# EAGLE schematic Adafruit ESP8266 Feather (EAGLE 9.6.2)
COMPANY: ADAFRUIT INDUSTRIES; DRAWN: KTOWN; REV: B

## Sheet 1 of 2
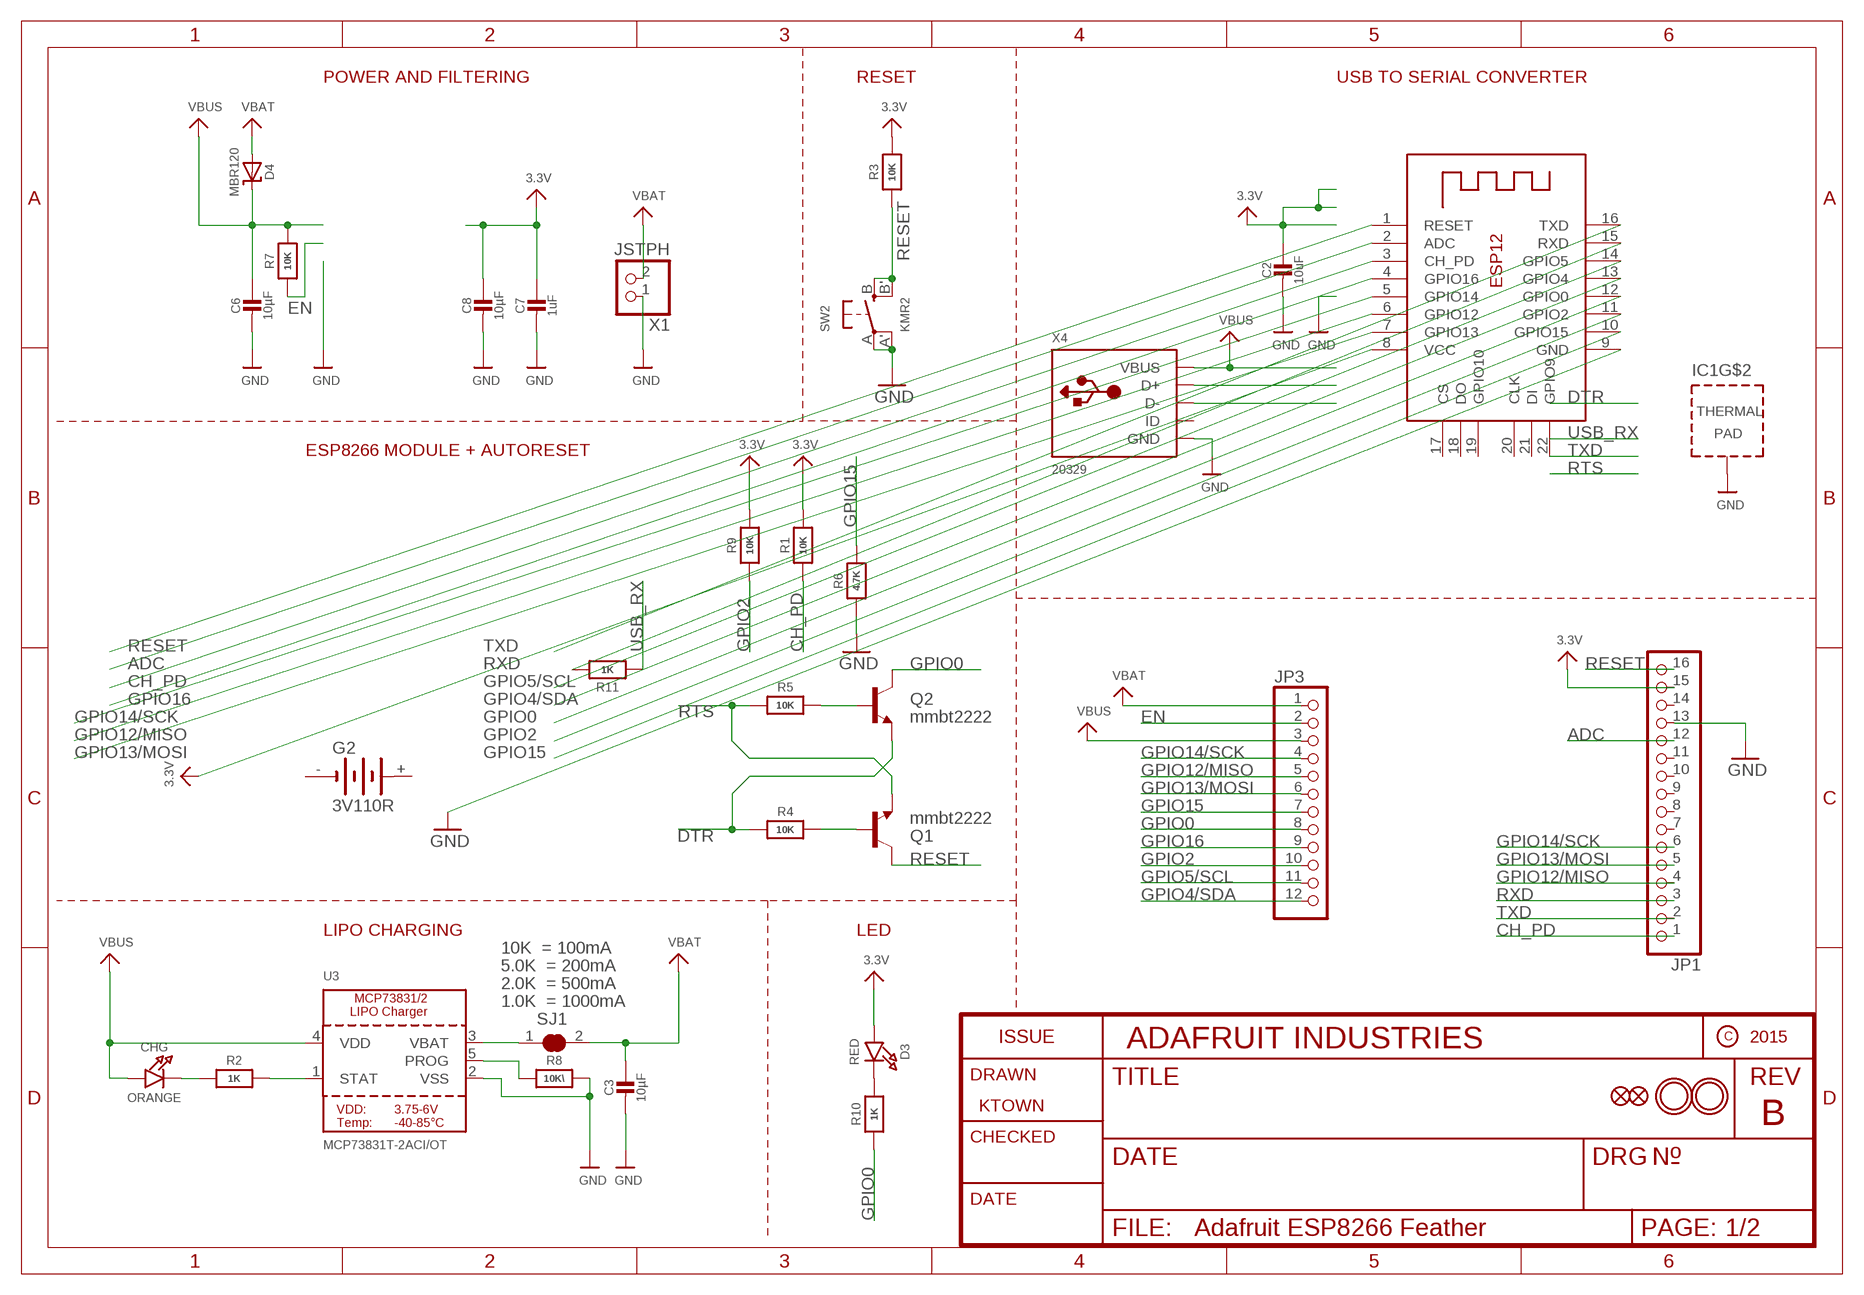
[diagram p0: schematic, sheet 1]

### Parts
C2  10uF  CAP_CERAMIC0805-NOOUTLINE  [0805-NO]
C3  10µF  CAP_CERAMIC0805-NOOUTLINE  [0805-NO]
C6  10µF  CAP_CERAMIC0805-NOOUTLINE  [0805-NO]
C7  1uF  CAP_CERAMIC0603_NO  [0603-NO]
C8  10µF  CAP_CERAMIC0805-NOOUTLINE  [0805-NO]
CHG  ORANGE  LED0805_NOOUTLINE  [CHIPLED_0805_NOOUTLINE]
D3  RED  LED0805_NOOUTLINE  [CHIPLED_0805_NOOUTLINE]
D4  MBR120  DIODE-SCHOTTKYSOD-123  [SOD-123]
G2  3V110R  [3V110R]
IC1  CP2104  [QFN24_4MM_SMSC]
JP1  HEADER-1X16ROUND  [1X16_ROUND]
JP3  HEADER-1X12  [1X12_ROUND]
Q1  mmbt2222  TRANSISTOR_NPNSOT23-3  [SOT23-3]
Q2  mmbt2222  TRANSISTOR_NPNSOT23-3  [SOT23-3]
R1  10K  RESISTOR_0603_NOOUT  [0603-NO]
R2  1K  RESISTOR_0603_NOOUT  [0603-NO]
R3  10K  RESISTOR_0603_NOOUT  [0603-NO]
R4  10K  RESISTOR_0603_NOOUT  [0603-NO]
R5  10K  RESISTOR_0603MP  [_0603MP]
R6  4.7K  RESISTOR_0603_NOOUT  [0603-NO]
R7  10K  RESISTOR_0603_NOOUT  [0603-NO]
R8  10K\  RESISTOR_0603_NOOUT  [0603-NO]
R9  10K  RESISTOR_0603_NOOUT  [0603-NO]
R10  1K  RESISTOR_0603_NOOUT  [0603-NO]
R11  1K  RESISTOR_0603MP  [_0603MP]
SJ1  SOLDERJUMPER_CLOSED  [SOLDERJUMPER_CLOSEDWIRE]
SW2  KMR2  SWITCH_TACT_SMT4.6X2.8  [BTN_KMR2_4.6X2.8]
U3  MCP73831T-2ACI/OT  MCP73831/2  [SOT23-5]
U$31  MOUNTINGHOLE2.5  [MOUNTINGHOLE_2.5_PLATED]
U$32  MOUNTINGHOLE2.5  [MOUNTINGHOLE_2.5_PLATED]
U$34  FIDUCIAL""  [FIDUCIAL_1MM]
U$35  FIDUCIAL""  [FIDUCIAL_1MM]
X1  JSTPH  CON_JST_PH_2PIN  [JSTPH2]
X2  ESP-12  ESP-12E  [ESP-12E]
X4  20329  USB_MICRO_20329_V2  [4UCONN_20329_V2]

### Nets
3.3V: C2.1 C7.1 C8.1 D3.A JP1.15 R1.2 R3.2 R9.2 X2.8(VCC)
ADC: JP1.12 X2.2(ADC)
CH_PD: JP1.1 R1.1 X2.3(CH_PD)
DTR: Q2.2(E) R4.1
EN: JP3.2 R7.1
GND: C2.2 C3.2 C6.2 C7.2 C8.2 IC1.THERM(TP) JP1.13 R6.1 R8.2 SW2.A'(P1) SW2.A(P) U3.2(VSS) X1.1 X2.9(GND) X4.BASE@1(GND) X4.BASE@2(GND) X4.GND X4.SPRT@1(GND) X4.SPRT@2(GND) X4.SPRT@3(GND) X4.SPRT@4(GND)
GPIO0: JP3.8 Q2.3(C) R10.1 X2.12(GPIO0)
GPIO2: JP3.10 R9.1 X2.11(GPIO2)
GPIO4/SDA: JP3.12 X2.13(GPIO4)
GPIO5/SCL: JP3.11 X2.14(GPIO5)
GPIO12/MISO: JP1.4 JP3.5 X2.6(GPIO12)
GPIO13/MOSI: JP1.5 JP3.6 X2.7(GPIO13)
GPIO14/SCK: JP1.6 JP3.4 X2.5(GPIO14)
GPIO15: JP3.7 R6.2 X2.10(GPIO15)
GPIO16: JP3.9 X2.4(GPIO16)
N$1: CHG.C R2.1
N$2: X4.D+
N$3: R2.2 U3.1(STAT)
N$4: R8.1 U3.5(PROG)
N$5: D3.C R10.2
N$6: X4.D-
N$7: SJ1.1 U3.3(VBAT)
N$12: Q1.1(B) R4.2
N$13: Q2.1(B) R5.2
RESET: JP1.16 Q1.3(C) R3.1 SW2.B'(S1) SW2.B(S) X2.1(RESET)
RTS: Q1.2(E) R5.1
RXD: JP1.3 R11.2 X2.15(RXD)
TXD: JP1.2 X2.16(TXD) X2.22(GPIO9)
USB_RX: R11.1
VBAT: C3.1 D4.A JP3.1 SJ1.2 X1.2
VBUS: C6.1 CHG.A D4.C JP3.3 R7.2 U3.4(VDD) X4.VBUS
Unconnected: G2.+ G2.+@1(+) G2.- IC1.1(RI) IC1.3(D+) IC1.4(D-) IC1.9(#RST) IC1.10(NC) IC1.11(GPIO3) IC1.12(GPIO2) IC1.13(GPIO1/RXLED) IC1.14(GPIO0/TXLED) IC1.15(#SUSPEND) IC1.16(VPP) IC1.17(SUSPEND) IC1.18(CTS) IC1.19(RTS) IC1.20(RXD) IC1.21(TXD) IC1.22(DSR) IC1.23(DTR) IC1.24(DCD) JP1.7 JP1.8 JP1.9 JP1.10 JP1.11 JP1.14 X2.17(CS) X2.18(DO) X2.19(GPIO10) X2.20(CLK) X2.21(DI) X4.ID

### Notes on the sheet
- POWER AND FILTERING | RESET | USB TO SERIAL CONVERTER
- ESP8266 MODULE + AUTORESET
- LIPO CHARGING | LED
- 10K  = 100mA
- 5.0K  = 200mA
- 2.0K  = 500mA
- 1.0K  = 1000mA

## Sheet 2 of 2
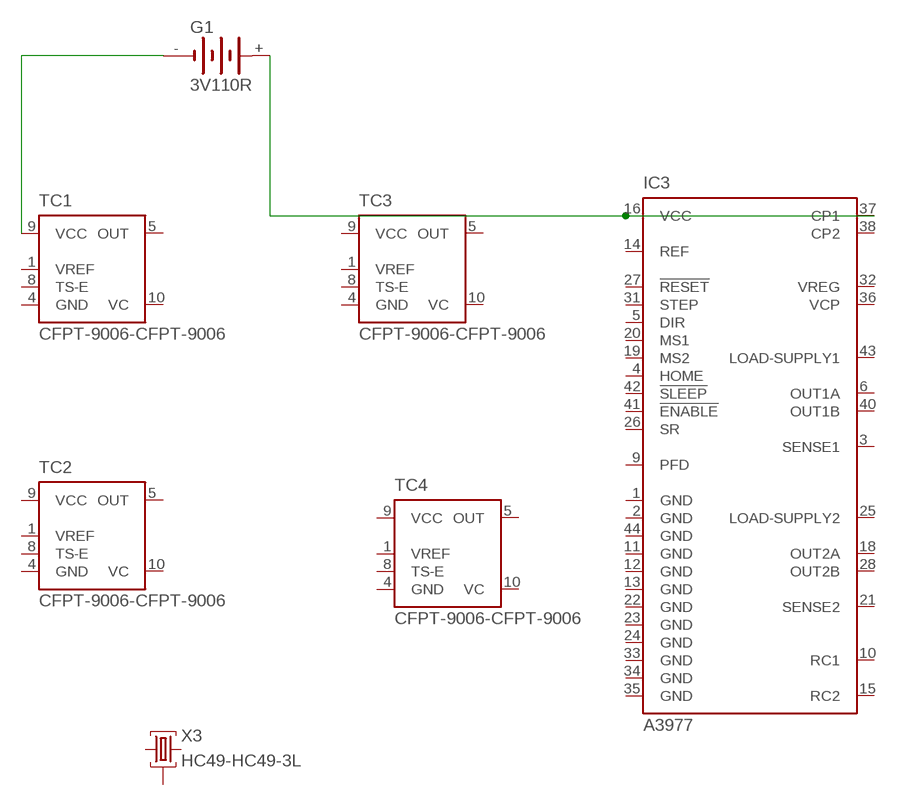
[diagram p1: schematic, sheet 2]

### Parts
G1  3V110R  [3V110R]
IC3  A3977  [PLCC44]
TC1  CFPT-9006-CFPT-9006  [7.0X5.0-10-PAD]
TC2  CFPT-9006-CFPT-9006  [7.0X5.0-10-PAD]
TC3  CFPT-9006-CFPT-9006  [7.0X5.0-10-PAD]
TC4  CFPT-9006-CFPT-9006  [7.0X5.0-10-PAD]
X3  HC49-HC49-3L  [HC49-3L]

### Nets
N$8: G1.- TC1.9(VCC)
N$9: G1.+ IC3.16(VCC) IC3.37(CP1)
Unconnected: G1.+@1(+) IC3.3(SENSE1) IC3.4(HOME) IC3.5(DIR) IC3.6(OUT1A) IC3.9(PFD) IC3.10(RC1) IC3.14(REF) IC3.15(RC2) IC3.18(OUT2A) IC3.19(MS2) IC3.20(MS1) IC3.21(SENSE2) IC3.25(LOAD-SUPPLY2) IC3.26(SR) IC3.27(!RESET) IC3.28(OUT2B) IC3.31(STEP) IC3.32(VREG) IC3.36(VCP) IC3.38(CP2) IC3.40(OUT1B) IC3.41(!ENABLE) IC3.42(!SLEEP) IC3.43(LOAD-SUPPLY1) TC1.1(VREF) TC1.5(OUT) TC1.8(TS-E) TC1.10(VC) TC2.1(VREF) TC2.5(OUT) TC2.8(TS-E) TC2.10(VC) TC3.1(VREF) TC3.5(OUT) TC3.8(TS-E) TC3.10(VC) TC4.1(VREF) TC4.5(OUT) TC4.8(TS-E) TC4.10(VC) X3.1 X3.2 X3.3

## Power pins joined to a net without a drawn wire
GND: IC1.2(GND) IC3.1(GND) IC3.2(GND) IC3.11(GND) IC3.12(GND) IC3.13(GND) IC3.22(GND) IC3.23(GND) IC3.24(GND) IC3.33(GND) IC3.34(GND) IC3.35(GND) IC3.44(GND) TC1.4(GND) TC2.4(GND) TC3.4(GND) TC4.4(GND)
REGIN: IC1.7(REGIN)
VBUS: IC1.8(VBUS)
VCC: TC2.9(VCC) TC3.9(VCC) TC4.9(VCC)
VDD: IC1.6(VDD)
VIO: IC1.5(VIO)

## Library data of the parts
C2 C3 C6-C8 = microbuilder:CAP_CERAMIC: Ceramic Capacitors For new designs, use the packages preceded by an '_' character since they are more reliable: The following footprints should be used on most boards: _0402 - Standard footprint for regular board layouts _0603 - Standard footprint for regular board layouts _0805 - Standard footprint for regular board layouts _1206 - Standard footprint for regular board layouts For extremely tight-pitch boards where space is at a premium, the following 'micro-pitch' footprints can be used (smaller pads, no silkscreen outline, etc.): _0402MP - Micro-pitch footprint for very dense/compact boards _0603MP - Micro-pitch footprint for very dense/compact boards _0805MP - Micro-pitch footprint for very dense/compact boards _1206MP - Micro-pitch footprint for very dense/compact boards
CHG D3 = microbuilder:LED: LED 0603 - 0603 Surface Mount Package 2mA: Green LED - Low Power (3.9mcd, 2ma, 1.7Vf) - Digikey: 475-2709-2-ND Orange LED - Low Power (9.8mcd, 2ma, 1.8Vf) - Digikey: 475-1194-2-ND Red LED - Low Power (5mcd, 2ma, 1.8Vf) - Digikey: 475-1195-2-ND Yellow LED - Low Power (7mcd, 2ma, 1.8Vf) - Digikey: 475-1196-2-ND 5mA: Blue LED - Low Power (17mcd, 5ma, 2.9Vf) - Digikey: LNJ937W8CRACT-ND 0805 - 0805 Surface Mount Package 2mA: Red LED (8.8mcd, 2mA, 1.8Vf, Clear) - Low Power [Digikey: 475-2510-1-ND] Green LED (5mcd, 2mA, 1.8Vf, Clear) - Low Power [Digikey: 475-2730-1-ND] Yellow LED (11.3mcd, 2mA, 1.8Vf, Clear) - Low Power [Digikey: 475-2555-1-ND] 20mA: Red LED (104mcd, 20mA, Diffused) - LS R976 [Digikey: 475-1278-6-ND] Red LED (12mcd, 20mA, 2.0Vf, Clear) - APT2012EC [Digikey: 754-1128-1-ND] Green LED (15mcd, 20mA, 2.2Vf, Clear) - APT2012GC [Digikey: 754-1131-1-ND] Orange LED (160mcd, 20mA, 2.1Vf, Clear) - APT2012SECK [Digikey: 754-1130-1-ND] 1206 - 1206 Surface Mount Package Green LED (26mcd, 20mA, Diffused) - LG N971 [Digikey: 475-1407-6-ND] Red LED (15mcd, 20mA, Diffused) - LH N974 [Digikey: 475-1416-6-ND] Cree - Cree High-Power Surface Mount LEDs XPEBWT-L1-0000-00D50 - White 111lm 350mA 2.9Vf 6200K 110° XTEAWT-00-0000-00000LEE3 - White 114lm 350mA 2.85Vf 5000K 115° Everlight - Everlight 45-21 Series Surface Mount LEDs 45-21/QK2C-B2832AC2CB2/2T - Warm White 2000mcd 20mA 3.25Vf 3050K 120° 45-21/LK2C-B38452C4CB2/2T - Nuetral White 2000mcd 20mA 3.25Vf 4150K 120° 45-21/LK2C-B50634C6CB2/2T - Cold White 2200mcd 20mA 3.25Vf 5650K 120° PLCC2 Reverse Mount LS T77K-J1L2-1-0-2-R18-Z - Red 11.25mcd 2mA 1.8Vf 630nm 120° LO T77K-L1M2-24-Z - Orange 19.6mcd 2mA 1.8Vf 606nm 120° LY T77K-K2M1-26-Z - Yellow 15.7mcd 2mA 1.8Vf 587nm 120°
D4 = microbuilder:DIODE-SCHOTTKY
G1 G2 = battery:3V110R: NC ACCU Varta
IC1 = microbuilder:CP2104: CP2104 - USB to UART Bridge VDD Output: 3.45V
IC3 = allegro:A3977: MICROSTEPPING DMOS DRIVER WITH TRANSLATOR Source: 3977.pdf; MF: ALLEGRO MICROSYSTEMS, INC.; MPN: A3977SED-T; OC_FARNELL: 1198089; OC_NEWARK: 31K6655
JP1 = microbuilder:HEADER-1X16: PIN HEADER
JP3 = microbuilder:HEADER-1X12
Q1 Q2 = SparkFun:TRANSISTOR_NPN: Transistor NPN BJT configuration in SOT23 package. MMBT2222 is the common NPN we use. Double check BCE configuration again layout.
R1-R11 = microbuilder:RESISTOR: Resistors For new designs, use the packages preceded by an '_' character since they are more reliable: The following footprints should be used on most boards: _0402 - Standard footprint for regular board layouts _0603 - Standard footprint for regular board layouts _0805 - Standard footprint for regular board layouts _1206 - Standard footprint for regular board layouts For extremely tight-pitch boards where space is at a premium, the following 'micro-pitch' footprints can be used (smaller pads, no silkscreen outline, etc.): _0402MP - Micro-pitch footprint for very dense/compact boards _0603MP - Micro-pitch footprint for very dense/compact boards _0805MP - Micro-pitch footprint for very dense/compact boards _1206MP - Micro-pitch footprint for very dense/compact boards
SJ1 = microbuilder:SOLDERJUMPER_CLOSED: Solder Jumper - Closed These solder jumpers are closed by default CLOSEDWIRE - 10 mil trace between pads that can be cut and resoldered later CLOSEDPERM - 63 mil trace between pads for a permanent connection (used to 'bridge' two signals, a shameless hack for Eagle). Can double as a test point as well (no cream layer)
SW2 = microbuilder:SWITCH_TACT_SMT: SMT Tact Switches 6x6mm - Digikey: P12940SCT-ND KMR2 (4.6x2.8mm) - Digikey: 401-1426-1-ND EVQ-PQHB55 - Light Touch, 160GF (4.5x4.5mm) - Digikey: P8090SCT-ND KMT0 - KMT021 NGJ LHS (etc.) IP68/Waterproof - Digikey: CKN10289CT-ND
TC1-TC4 = IQD-Frequency-Products:CFPT-9006: Temperature Compensated Xtal Oscillator; MFD: IQD Frequency Products
U3 = microbuilder:MCP73831/2: MCP73831/2 LIPO Charger VDD: 3.75 - 6V Temp -40 - 85°C Programmable Charge Rate: 15-500mA NOTE: STAT is a tri-state logic output on the MCP73831 and an open-drain output on the MCP73832. SOT23-5 with 4.2V output and tri-state logic on STAT = MCP73831T-2ACI/OT
U$31 U$32 = microbuilder:MOUNTINGHOLE: Mounting Hole For #2 screws (0.086"/2.18mm width, 0.094"/2.4mm hole) use 2.5mm; BOM: EXCLUDE
U$34 U$35 = microbuilder:FIDUCIAL: Fiducial Alignment Points Various fiducial points for machine vision alignment.; BOM: EXCLUDE
X1 = microbuilder:CON_JST_PH_2PIN: JST 2-Pin Right-Angle Connector PH-Series - 4UConnector: 17311 SH-Series - 4UConnector: 07278
X2 = microbuilder:ESP-12E
X3 = IQD-Frequency-Products:HC49: Crystals; MFD: IQD Frequency Products
X4 = microbuilder:USB: USB Connectors USBMINIB - Surface Mount Female Mini-B USB Connector 4UConnector: 06564